# EAGLE board altera_dev_brd (EAGLE 4.16)
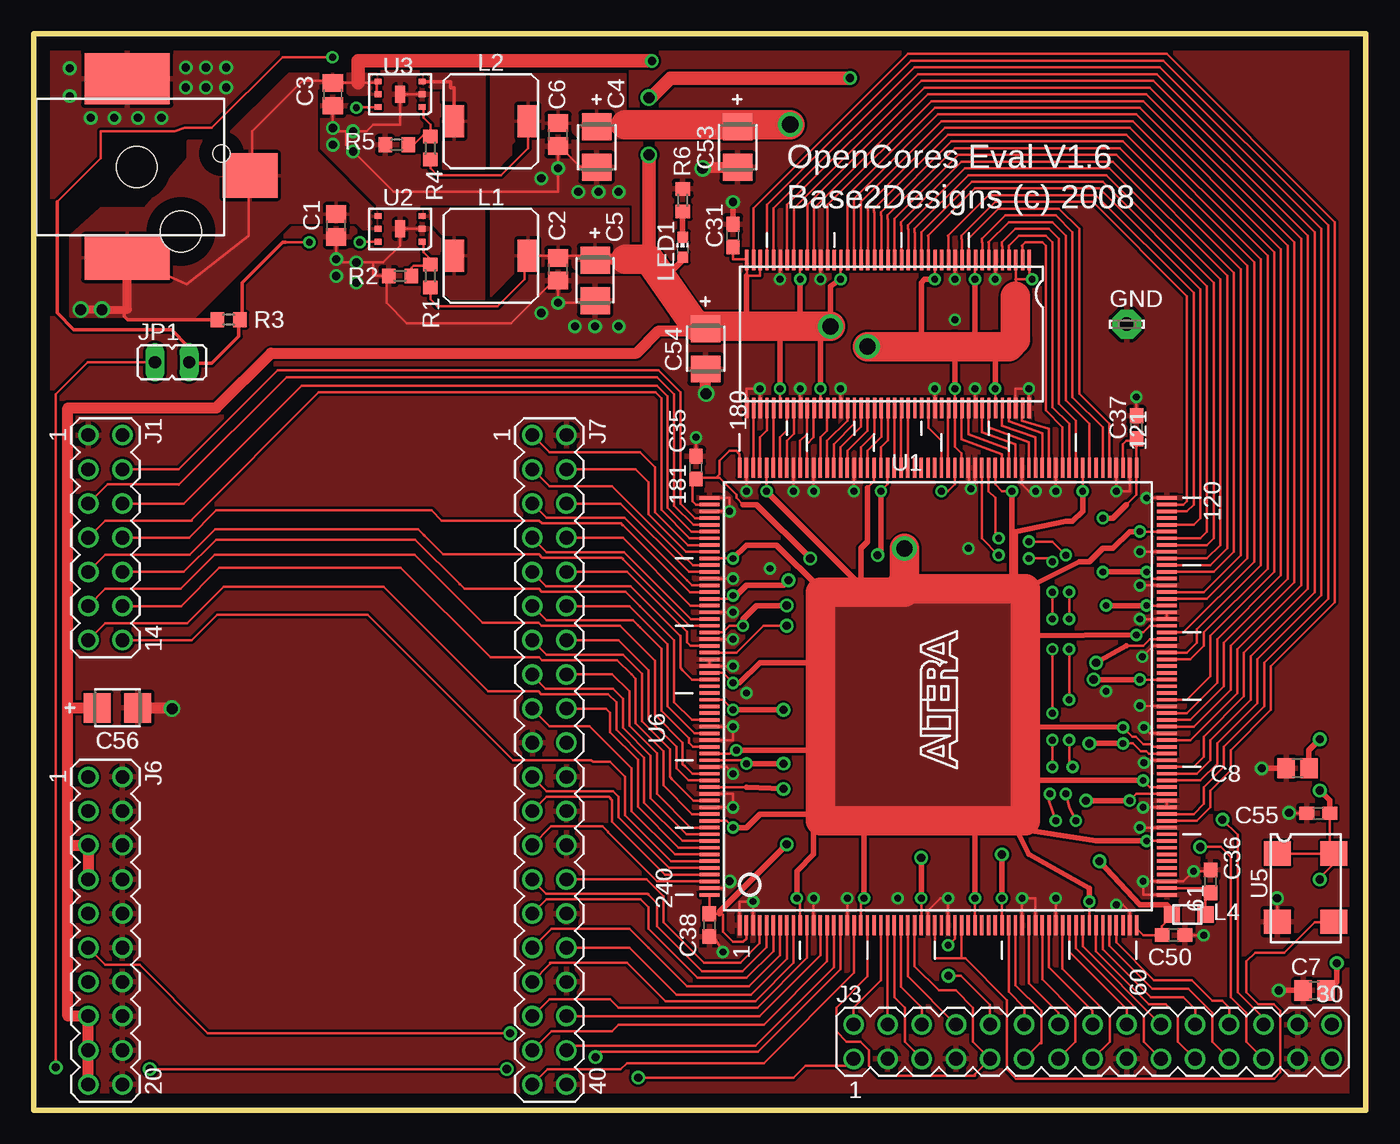
[diagram p1: board, top side]
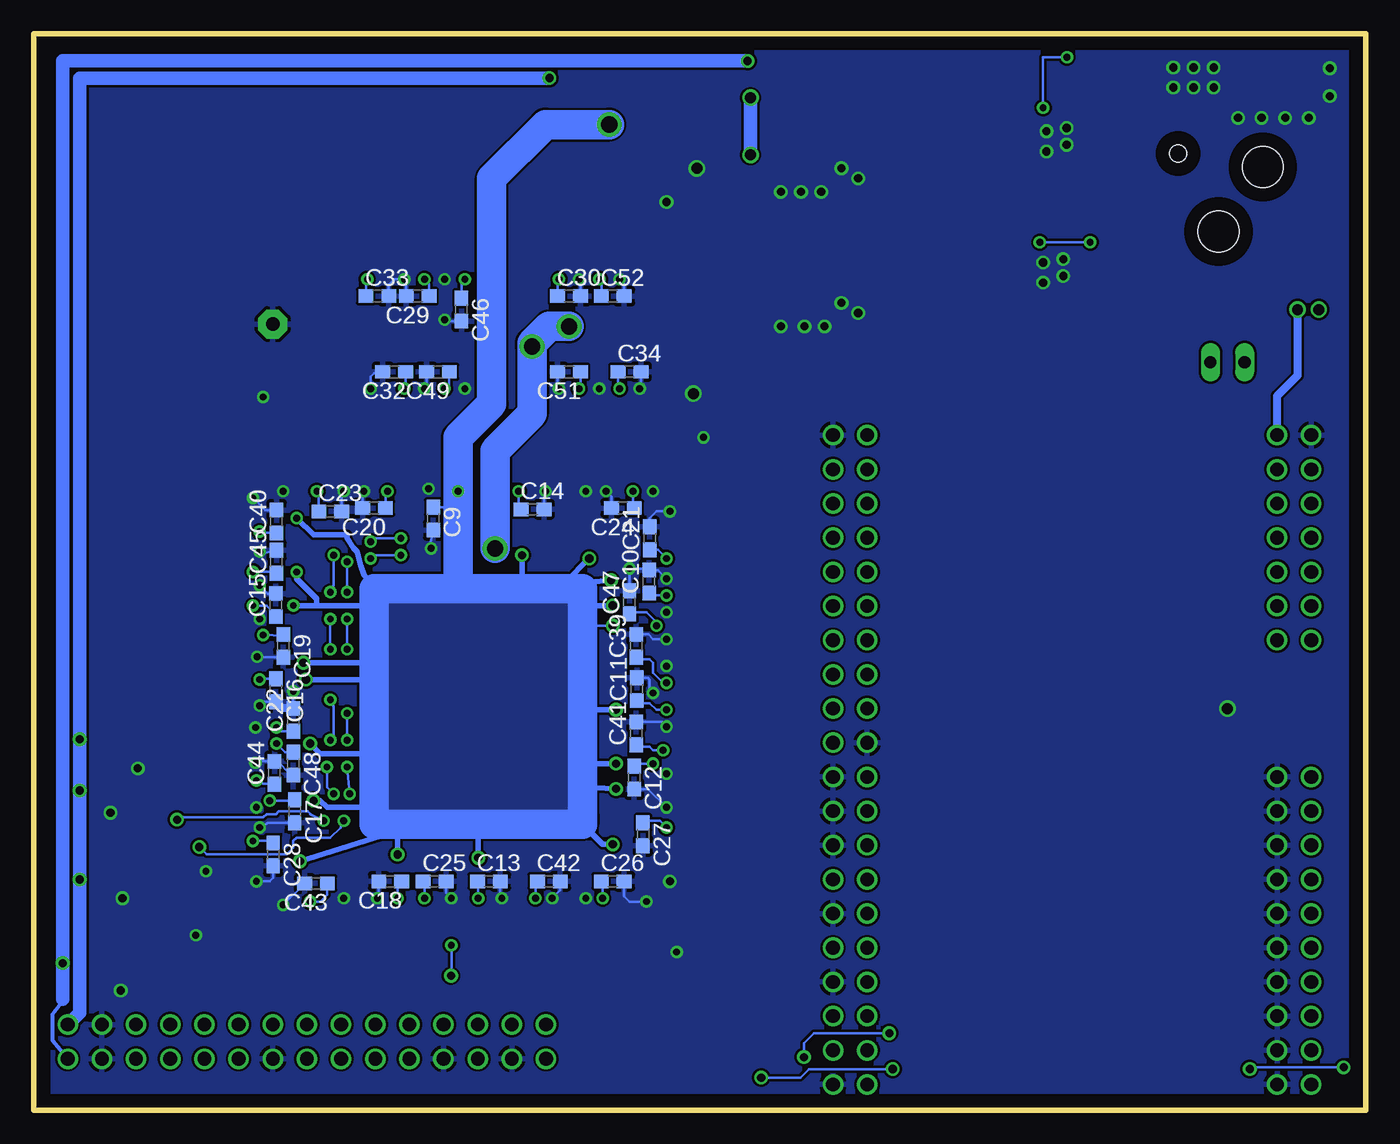
[diagram p2: board, bottom side, seen from below]

Size 99.06 x 80.01 mm. Coordinates in mm from the lower left corner, seen from the top.
Outline: 0,0 0,80.01 99.06,80.01 99.06,0 0,0
Copper layers (1*16): Top 0.035mm / dielectric 1.5mm / Bottom 0.035mm
Design rules "default": minimum track width 8mil, minimum drill 20mil, track to track 7mil, track to pad 7mil, pad to pad 7mil, via to via 7mil, smd to smd 7mil, copper to edge 40mil, drill to drill 8mil, minimum pad ring 10mil, minimum via ring 8mil, stop-mask expansion 3mil, vias tented up to drill 50mil, thermal gap 10mil

## Footprints (pad centres in the part's own frame; a part is rotated, then mirrored left to right if it is on the bottom)
C0805 = smd 1.3 x 1.5: 1 -0.85,0; 2 0.85,0
CT3528 = smd 2 x 2.2: + 1.5,0; - -1.5,0
C0603 = smd 1.1 x 1: 1 -0.85,0; 2 0.85,0
LSP10 = drill 1.016 pad 2.159 octagon: MP 0,0
MA07-2_TH = drill 1.016 pad 1.397 round: 1 -7.62,-1.27; 2 -7.62,1.27; 3 -5.08,-1.27; 4 -5.08,1.27; 5 -2.54,-1.27; 6 -2.54,1.27; 7 0,-1.27; 8 0,1.27; 9 2.54,-1.27; 10 2.54,1.27; 11 5.08,-1.27; 12 5.08,1.27; 13 7.62,-1.27; 14 7.62,1.27
RASH722 = smd 3.81 x 6.35: 1 -6.553,6.756 | smd 3.302 x 6.35: 2 6.731,6.756 | smd 3.302 x 4.064: 3 0.635,15.9 | hole 3.048: 0,7.468; 4.801,10.744 | hole 1.27: -1.016,13.767
MA15-2_TH = drill 1.016 pad 1.397 round: 1 -17.78,-1.27; 2 -17.78,1.27; 3 -15.24,-1.27; 4 -15.24,1.27; 5 -12.7,-1.27; 6 -12.7,1.27; 7 -10.16,-1.27; 8 -10.16,1.27; 9 -7.62,-1.27; 10 -7.62,1.27; 11 -5.08,-1.27; 12 -5.08,1.27; 13 -2.54,-1.27; 14 -2.54,1.27; 15 0,-1.27; 16 0,1.27; 17 2.54,-1.27; 18 2.54,1.27; 19 5.08,-1.27; 20 5.08,1.27; 21 7.62,-1.27; 22 7.62,1.27; 23 10.16,-1.27; 24 10.16,1.27; 25 12.7,-1.27; 26 12.7,1.27; 27 15.24,-1.27; 28 15.24,1.27; 29 17.78,-1.27; 30 17.78,1.27
MA10-2_TH = drill 1.016 pad 1.397 round: 1 -11.43,-1.27; 2 -11.43,1.27; 3 -8.89,-1.27; 4 -8.89,1.27; 5 -6.35,-1.27; 6 -6.35,1.27; 7 -3.81,-1.27; 8 -3.81,1.27; 9 -1.27,-1.27; 10 -1.27,1.27; 11 1.27,-1.27; 12 1.27,1.27; 13 3.81,-1.27; 14 3.81,1.27; 15 6.35,-1.27; 16 6.35,1.27; 17 8.89,-1.27; 18 8.89,1.27; 19 11.43,-1.27; 20 11.43,1.27
MA20-2_TH = drill 1.016 pad 1.397 round: 1 -24.13,-1.27; 2 -24.13,1.27; 3 -21.59,-1.27; 4 -21.59,1.27; 5 -19.05,-1.27; 6 -19.05,1.27; 7 -16.51,-1.27; 8 -16.51,1.27; 9 -13.97,-1.27; 10 -13.97,1.27; 11 -11.43,-1.27; 12 -11.43,1.27; 13 -8.89,-1.27; 14 -8.89,1.27; 15 -6.35,-1.27; 16 -6.35,1.27; 17 -3.81,-1.27; 18 -3.81,1.27; 19 -1.27,-1.27; 20 -1.27,1.27; 21 1.27,-1.27; 22 1.27,1.27; 23 3.81,-1.27; 24 3.81,1.27; 25 6.35,-1.27; 26 6.35,1.27; 27 8.89,-1.27; 28 8.89,1.27; 29 11.43,-1.27; 30 11.43,1.27; 31 13.97,-1.27; 32 13.97,1.27; 33 16.51,-1.27; 34 16.51,1.27; 35 19.05,-1.27; 36 19.05,1.27; 37 21.59,-1.27; 38 21.59,1.27; 39 24.13,-1.27; 40 24.13,1.27
JP1 = drill 0.914 long: 1 0,-1.27; 2 0,1.27
B82462G4 = smd 1.5 x 2.4: 1 -2.75,0; 2 2.75,0
IND_PANASONIC_0603 = smd 1.2 x 1.2: 1 0,0; 2 0,2.5
CHIP-LED0603 = smd 0.8 x 0.8: A 0,-0.75; C 0,0.75
R0603 = smd 1 x 1.1: 1 -0.85,0; 2 0.85,0
TSOP86 = smd 0.254 x 1.499: 1 -10.5,-5.5; 2 -10,-5.5; 3 -9.5,-5.5; 4 -9,-5.5; 5 -8.5,-5.5; 6 -8,-5.5; 7 -7.5,-5.5; 8 -7,-5.5; 9 -6.5,-5.5; 10 -6,-5.5; 11 -5.5,-5.5; 12 -5,-5.5; 13 -4.5,-5.5; 14 -4,-5.5; 15 -3.5,-5.5; 16 -3,-5.5; 17 -2.5,-5.5; 18 -2,-5.5; 19 -1.5,-5.5; 20 -1,-5.5; 21 -0.5,-5.5; 22 0,-5.5; 23 0.5,-5.5; 24 1,-5.5; 25 1.5,-5.5; 26 2,-5.5; 27 2.5,-5.5; 28 3,-5.5; 29 3.5,-5.5; 30 4,-5.5; 31 4.5,-5.5; 32 5,-5.5; 33 5.5,-5.5; 34 6,-5.5; 35 6.5,-5.5; 36 7,-5.5; 37 7.5,-5.5; 38 8,-5.5; 39 8.5,-5.5; 40 9,-5.5; 41 9.5,-5.5; 42 10,-5.5; 43 10.5,-5.5; 44 10.5,5.5; 45 10,5.5; 46 9.5,5.5; 47 9,5.5; 48 8.5,5.5; 49 8,5.5; 50 7.5,5.5; 51 7,5.5; 52 6.5,5.5; 53 6,5.5; 54 5.5,5.5; 55 5,5.5; 56 4.5,5.5; 57 4,5.5; 58 3.5,5.5; 59 3,5.5; 60 2.5,5.5; 61 2,5.5; 62 1.5,5.5; 63 1,5.5; 64 0.5,5.5; 65 0,5.5; 66 -0.5,5.5; 67 -1,5.5; 68 -1.5,5.5; 69 -2,5.5; 70 -2.5,5.5; 71 -3,5.5; 72 -3.5,5.5; 73 -4,5.5; 74 -4.5,5.5; 75 -5,5.5; 76 -5.5,5.5; 77 -6,5.5; 78 -6.5,5.5; 79 -7,5.5; 80 -7.5,5.5; 81 -8,5.5; 82 -8.5,5.5; 83 -9,5.5; 84 -9.5,5.5; 85 -10,5.5; 86 -10.5,5.5
DFN6 = smd 0.5 x 0.43: 1 -1.89,0.95; 2 -1.89,0; 3 -1.89,-0.95; 4 1.39,-0.95; 5 1.39,0; 6 1.39,0.95 | smd 0.73 x 1.27: 7 -0.25,0
OSC_7MM = smd 1.8 x 2: 1 -5.08,0; 2 0,0; 3 0,4.2; 4 -5.08,4.2
PQFP240 = smd 1.499 x 0.254: 1 -2.25,31.5; 2 -2.25,31; 3 -2.25,30.5; 4 -2.25,30; 5 -2.25,29.5; 6 -2.25,29; 7 -2.25,28.5; 8 -2.25,28; 9 -2.25,27.5; 10 -2.25,27; 11 -2.25,26.5; 12 -2.25,26; 13 -2.25,25.5; 14 -2.25,25; 15 -2.25,24.5; 16 -2.25,24; 17 -2.25,23.5; 18 -2.25,23; 19 -2.25,22.5; 20 -2.25,22; 21 -2.25,21.5; 22 -2.25,21; 23 -2.25,20.5; 24 -2.25,20; 25 -2.25,19.5; 26 -2.25,19; 27 -2.25,18.5; 28 -2.25,18; 29 -2.25,17.5; 30 -2.25,17; 31 -2.25,16.5; 32 -2.25,16; 33 -2.25,15.5; 34 -2.25,15; 35 -2.25,14.5; 36 -2.25,14; 37 -2.25,13.5; 38 -2.25,13; 39 -2.25,12.5; 40 -2.25,12; 41 -2.25,11.5; 42 -2.25,11; 43 -2.25,10.5; 44 -2.25,10; 45 -2.25,9.5; 46 -2.25,9; 47 -2.25,8.5; 48 -2.25,8; 49 -2.25,7.5; 50 -2.25,7; 51 -2.25,6.5; 52 -2.25,6; 53 -2.25,5.5; 54 -2.25,5; 55 -2.25,4.5; 56 -2.25,4; 57 -2.25,3.5; 58 -2.25,3; 59 -2.25,2.5; 60 -2.25,2; 121 31.75,2; 122 31.75,2.5; 123 31.75,3; 124 31.75,3.5; 125 31.75,4; 126 31.75,4.5; 127 31.75,5; 128 31.75,5.5; 129 31.75,6; 130 31.75,6.5; 131 31.75,7; 132 31.75,7.5; 133 31.75,8; 134 31.75,8.5; 135 31.75,9; 136 31.75,9.5; 137 31.75,10; 138 31.75,10.5; 139 31.75,11; 140 31.75,11.5; 141 31.75,12; 142 31.75,12.5; 143 31.75,13; 144 31.75,13.5; 145 31.75,14; 146 31.75,14.5; 147 31.75,15; 148 31.75,15.5; 149 31.75,16; 150 31.75,16.5; 151 31.75,17; 152 31.75,17.5; 153 31.75,18; 154 31.75,18.5; 155 31.75,19; 156 31.75,19.5; 157 31.75,20; 158 31.75,20.5; 159 31.75,21; 160 31.75,21.5; 161 31.75,22; 162 31.75,22.5; 163 31.75,23; 164 31.75,23.5; 165 31.75,24; 166 31.75,24.5; 167 31.75,25; 168 31.75,25.5; 169 31.75,26; 170 31.75,26.5; 171 31.75,27; 172 31.75,27.5; 173 31.75,28; 174 31.75,28.5; 175 31.75,29; 176 31.75,29.5; 177 31.75,30; 178 31.75,30.5; 179 31.75,31; 180 31.75,31.5 | smd 0.254 x 1.499: 61 0,-0.25; 62 0.5,-0.25; 63 1,-0.25; 64 1.5,-0.25; 65 2,-0.25; 66 2.5,-0.25; 67 3,-0.25; 68 3.5,-0.25; 69 4,-0.25; 70 4.5,-0.25; 71 5,-0.25; 72 5.5,-0.25; 73 6,-0.25; 74 6.5,-0.25; 75 7,-0.25; 76 7.5,-0.25; 77 8,-0.25; 78 8.5,-0.25; 79 9,-0.25; 80 9.5,-0.25; 81 10,-0.25; 82 10.5,-0.25; 83 11,-0.25; 84 11.5,-0.25; 85 12,-0.25; 86 12.5,-0.25; 87 13,-0.25; 88 13.5,-0.25; 89 14,-0.25; 90 14.5,-0.25; 91 15,-0.25; 92 15.5,-0.25; 93 16,-0.25; 94 16.5,-0.25; 95 17,-0.25; 96 17.5,-0.25; 97 18,-0.25; 98 18.5,-0.25; 99 19,-0.25; 100 19.5,-0.25; 101 20,-0.25; 102 20.5,-0.25; 103 21,-0.25; 104 21.5,-0.25; 105 22,-0.25; 106 22.5,-0.25; 107 23,-0.25; 108 23.5,-0.25; 109 24,-0.25; 110 24.5,-0.25; 111 25,-0.25; 112 25.5,-0.25; 113 26,-0.25; 114 26.5,-0.25; 115 27,-0.25; 116 27.5,-0.25; 117 28,-0.25; 118 28.5,-0.25; 119 29,-0.25; 120 29.5,-0.25; 181 29.5,33.75; 182 29,33.75; 183 28.5,33.75; 184 28,33.75; 185 27.5,33.75; 186 27,33.75; 187 26.5,33.75; 188 26,33.75; 189 25.5,33.75; 190 25,33.75; 191 24.5,33.75; 192 24,33.75; 193 23.5,33.75; 194 23,33.75; 195 22.5,33.75; 196 22,33.75; 197 21.5,33.75; 198 21,33.75; 199 20.5,33.75; 200 20,33.75; 201 19.5,33.75; 202 19,33.75; 203 18.5,33.75; 204 18,33.75; 205 17.5,33.75; 206 17,33.75; 207 16.5,33.75; 208 16,33.75; 209 15.5,33.75; 210 15,33.75; 211 14.5,33.75; 212 14,33.75; 213 13.5,33.75; 214 13,33.75; 215 12.5,33.75; 216 12,33.75; 217 11.5,33.75; 218 11,33.75; 219 10.5,33.75; 220 10,33.75; 221 9.5,33.75; 222 9,33.75; 223 8.5,33.75; 224 8,33.75; 225 7.5,33.75; 226 7,33.75; 227 6.5,33.75; 228 6,33.75; 229 5.5,33.75; 230 5,33.75; 231 4.5,33.75; 232 4,33.75; 233 3.5,33.75; 234 3,33.75; 235 2.5,33.75; 236 2,33.75; 237 1.5,33.75; 238 1,33.75; 239 0.5,33.75; 240 0,33.75

## Placement (x,y rotation side)
C1  4.7uF  [C0805]  22.5,65.75 270 top
C2  22uF  [C0805]  39,62.5 270 top
C3  4.7uF  [C0805]  22.25,75.5 270 top
C4  100uF  [CT3528]  41.87,71.58 90 top
C5  100uF  [CT3528]  41.75,61.67 90 top
C6  22uF  [C0805]  39,72.5 270 top
C7  4.7uF  [C0805]  95.25,8.89 180 top
C8  22uF  [C0805]  93.98,25.4 180 top
C9  0.1uF  [C0603]  69.35,43.96 270 bottom
C10  0.1uF  [C0603]  53.3,39.29 90 bottom
C11  0.1uF  [C0603]  54.2,31.29 90 bottom
C12  0.1uF  [C0603]  54.4,24.71 270 bottom
C13  0.1uF  [C0603]  65.21,17 0 bottom
C14  0.1uF  [C0603]  61.96,44.65 0 bottom
C15  0.1uF  [C0603]  81.05,37.54 90 bottom
C16  0.1uF  [C0603]  81.05,31.21 270 bottom
C17  0.1uF  [C0603]  79.65,22.21 270 bottom
C18  0.1uF  [C0603]  72.54,17 180 bottom
C19  0.1uF  [C0603]  80.5,34.5 270 bottom
C20  0.1uF  [C0603]  73.75,44.75 180 bottom
C21  0.1uF  [C0603]  53.25,42.5 90 bottom
C22  0.1uF  [C0603]  79.75,29 90 bottom
C23  0.1uF  [C0603]  77,44.5 0 bottom
C24  0.1uF  [C0603]  55.25,44.75 180 bottom
C25  0.1uF  [C0603]  69.25,17 0 bottom
C26  0.1uF  [C0603]  56,17 0 bottom
C27  0.1uF  [C0603]  53.75,20.5 270 bottom
C28  0.1uF  [C0603]  81.25,19 270 bottom
C29  0.1uF  [C0603]  70.5,60.5 180 bottom
C30  0.1uF  [C0603]  59.25,60.5 0 bottom
C31  0.1uF  [C0603]  52,65 90 top
C32  0.1uF  [C0603]  72.25,54.88 180 bottom
C33  0.1uF  [C0603]  73.5,60.5 0 bottom
C34  0.1uF  [C0603]  54.75,54.88 0 bottom
C35  0.1uF  [C0603]  49.25,47.75 90 top
C36  0.1uF  [C0603]  87.5,17 90 top
C37  0.1uF  [C0603]  82,50.75 90 top
C38  0.1uF  [C0603]  50.25,13.75 270 top
C39  0.1uF  [C0603]  54.25,34.5 90 bottom
C40  0.1uF  [C0603]  81,43.75 90 bottom
C41  0.1uF  [C0603]  54.25,28 90 bottom
C42  0.1uF  [C0603]  60.75,17 0 bottom
C43  0.1uF  [C0603]  78.06,16.85 180 bottom
C44  0.1uF  [C0603]  81.15,25.06 90 bottom
C45  0.1uF  [C0603]  81,40.75 90 bottom
C46  0.1uF  [C0603]  67.25,59.5 270 bottom
C47  0.1uF  [C0603]  54.75,37.75 90 bottom
C48  0.1uF  [C0603]  79.75,25.75 270 bottom
C49  0.1uF  [C0603]  69,54.88 180 bottom
C50  0.1uF  [C0603]  84.75,13 0 top
C51  0.1uF  [C0603]  59.25,54.88 180 bottom
C52  0.1uF  [C0603]  56,60.5 0 bottom
C53  100uF  [CT3528]  52.35,71.58 90 top
C54  100uF  [CT3528]  49.97,56.58 90 top
C55  0.1uF  [C0603]  95.52,22.06 180 top
C56  100uF  [CT3528]  6.23,29.9 180 top
GND  LSP10  [LSP10]  81.28,58.42 0 top
J1  MA07-2_TH  [MA07-2_TH]  5.33,42.55 270 top
J2  RASH722  [RASH722]  0.2,70.1 270 top
J3  MA15-2_TH  [MA15-2_TH]  78.74,5.08 0 top
J6  MA10-2_TH  [MA10-2_TH]  5.33,13.34 270 top
J7  MA20-2_TH  [MA20-2_TH]  38.35,26.04 270 top
JP1  [JP1]  10.29,55.58 270 top
L1  B82462G4332  [B82462G4]  34,63.5 0 top
L2  B82462G4332  [B82462G4]  34,73.5 0 top
L4  EXC-ML20A390U  [IND_PANASONIC_0603]  87.14,14.54 90 top
LED1  [CHIP-LED0603]  48.26,64.14 0 top
R1  158K  [R0603]  29.5,62 270 top
R2  49.9K  [R0603]  27.25,62 0 top
R3  100K  [R0603]  14.5,58.75 0 top
R4  24.9K  [R0603]  29.5,71.5 270 top
R5  49.9K  [R0603]  27,71.75 0 top
R6  330R  [R0603]  48.26,67.63 270 top
U1  MT48LC4M32B2TG-6  [TSOP86]  63.53,57.68 180 top
U2  ST1S06PMR  [DFN6]  27,65.5 180 top
U3  ST1S06PMR  [DFN6]  27,75.5 180 top
U5  CB3LV-3I-48M0000  [OSC_7MM]  92.48,13.99 270 top
U6  EP2C20Q240C8N  [PQFP240]  84,16 90 top

## Tracks (layer width: path | path; a pad name or v marks a point on that pad's centre or on a via)
+1V2  (via drill 0.51, 0.61, 1.22)
  Top 0.203: R4.2 29.5,70 30,69.5 34.75,69.5 36.75,71.5 L2.2 | 49.25,46.75 49.25,46.5 | U6.182 49.25,45 49,45.25 49,46.5 49.25,46.75 | 49.25,46.75 C35.1 49.25,47 50.75,47 | U6.123 81,49.5 81.25,49.75 81.75,49.75 82,50 C37.1 U6.121 82,45.75 81.25,45 | U6.180 52.5,48.75 52.25,49 51.75,49 51,48.25 51,47.25 50.75,47 | U6.240 C38.1 51,14.6 | 51,14.6 51.15,14.6 51.25,14.5 51.25,13.25 52,12.5 52.75,12.5 53,12.75 U6.2 | v67.5,46 68,46 68.5,46.5 U6.148 | U6.108 83.25,39.5 v82.75,40 | v82.75,37.5 U6.104 | U6.158 63.5,46.5 v63,46 | U6.201 51.25,35.5 51.75,36 v52.75,36 | U6.196 51.75,38 v52,38.25 | U6.211 51.25,30.5 v52,29.75 | U6.220 52.75,26 v53,25.75 | v66,15.75 U6.28 | v72,15.75 U6.40 | U6.76 82,23.5 v81.5,23 | v82.25,32 U6.93 | 50.75,47 51,47 52.25,45.75 52.25,45.5 52.75,45 | U6.204 52.25,34 54.25,36 v56,36 | 53,24 U6.224 | 51,14.6 51.1,14.6 | U6.99 83,35 82.5,34.5 81.25,34.5 | U6.60 82,13.5 82.5,13 C50.1 83.9,13.65 84.75,14.5 84.71,14.54 L4.2 | U6.82 82.94,26.5 82.75,26.69 82.31,26.69 81.75,27.25 v81,27.25
  Top 0.406: v63,46 63,41.5 v62.75,41.25 | 52.75,45 53.75,45 v57.75,41 | v52,38.25 52.25,38.25 53,39 55.75,39 v56.13,39.38 | v52.75,36 52.75,36.5 53.75,37.5 v56,37.5 | v55.75,29.75 v52,29.75 | v55.75,25.75 v53,25.75 | v55.75,23.87 53,24 | 51,14.6 51,14.75 v56,19.75 | v66,18.75 v66,15.75 | v72,19 v72,15.75 | L4.2 84.64,14.86 84.25,15.25 82.25,15.25 v79.25,18.5 | v78.25,23 v81.5,23 | v78.5,27.25 v81,27.25 | v78.81,32 v82.25,32 | v79,33.25 81.25,34.5 | v79.75,37.5 v82.75,37.5 | v79.5,40 v82.75,40 | v79.5,44 80.25,44 81.25,45
  Top 0.813: C4.+ 43.83,73.08 43.88,73.12 | 44,73.25 43.88,73.12 | 43.88,73.12 44,73 44.08,73.08 C53.+
  Top 2.184: v56.25,73.25 44,73.25
  Bottom 0.203: C9.1 67.56,44.81 67.5,44.75 | C45.1 81,40 v82.75,40 | C15.1 81,36.75 81.75,37.5 v82.75,37.5 | C14.1 62.9,44.65 63,44.75 v63,46 | v52.75,36 52.75,36.25 53.5,37 54.75,37 C47.1 | C10.1 53.25,38.5 53,38.25 v52,38.25 | v52,29.75 52.75,29.75 53.25,30.25 54,30.25 C11.1 | C11.1 54.25,30.5 | C11.1 | C12.1 54.4,25.65 54.5,25.75 v53,25.75 | C13.1 66,17 v66,15.75 | C18.1 71.5,17 72,16.5 v72,15.75 | C17.1 79.69,23.06 79.75,23 v81.5,23 | C48.1 80.35,26.6 v81,27.25 | C16.1 82.19,32.06 v82.25,32 | 58.25,36 v56,36
  Bottom 0.406: 62.75,38.5 62.75,38.75 v62.75,41.25 | 59.5,38.75 59.5,39.25 v57.75,41 | v56.13,39.38 57.75,39.25 58.25,38.75 | 58.25,38 58,38 57.5,37.5 v56,37.5 | 58.25,29.75 v55.75,29.75 | 58.5,25.75 58.25,25.75 v55.75,25.75 | 58.25,24 v55.75,23.87 | v56,19.75 56.75,19.75 59,22 58.25,22 58,22 | v66,18.75 66,21 66.25,21.25 | 72,21.25 72,20.75 | 72,20.75 v72,19 | 72,20.75 73.75,22 | 72,20.75 v79.25,18.5 | 73.75,27.5 74,27.5 74.25,27.25 | 73.5,32 73.75,32 v78.81,32 | 73.75,37.5 78,37.5 | 78,37.5 v79.75,37.5 | 74.25,39.25 74,38 73.75,38.75 74,39 74,39.25 74.5,39.75 74.75,40.5 75,41.5 75.25,41.75 75.75,42.5 75.75,42.75 78.25,42.75 v79.5,44 | 78,37.5 78,38 79.5,39.5 v79.5,40 | v78.5,27.25 77.75,26.5 73.75,26.5 | v78.25,23 77.75,23 77.25,22.5 73.75,22.5 | 73.75,33 74,33 73.75,33.25 v79,33.25
  Bottom 2.184: v56.25,73.25 61,73.25 65,69.25 65,52.5 67.5,50 v67.5,46 67.5,44.75 67.5,38.75 | 67.5,38.75 62.75,38.75 59.5,38.75 58.25,38.75 58.25,38 58.25,36 58.25,29.75 58.25,25.75 58.25,24 58.25,22 58.25,21.25 66.25,21.25 72,21.25 73.75,21.25 73.75,22 73.75,22.5 73.75,26.5 73.75,27.5 73.75,32 73.75,33 73.75,33.25 73.75,37.5 73.75,38.75 67.5,38.75
  pour Top: 34,77 44,77 44,72.25 40.5,72.25 40,72.75 39.75,73 38,73 37.5,72.5 36.25,72.5 35.5,71.75 35.5,71 34.75,70.25 34.5,70 34,70
  pour Bottom: 58,39 74,39 74,21 58,21
+3V3  (via drill 0.51, 0.61, 0.81, 1.22)
  Top 0.203: R1.2 29.5,60.25 30,59.75 34.5,59.75 36.5,61.75 36.5,63.25 L1.2 39,63.5 C2.1 39,63.25 39.25,63.5 41.5,63.5 41.75,63.25 C5.+ | C31.1 52,63.25 53,63.25 53.03,63.22 U1.43 53.03,62.03 53,62 54,62 54,63.25 54.03,63.22 U1.41 | U1.35 57.03,63.03 57,63 v57,61.75 | U1.29 60.03,63.03 60,63 v60,61.75 | U1.49 55.53,52.22 55.5,52.25 v55.5,53.63 | U1.55 58.53,52.22 58.5,52.25 v58.5,53.63 | U1.15 67.03,63.03 67,63 v67,61.75 | U1.9 70.03,63.03 70,63 v70,61.75 | U1.1 74.03,61.97 v74.25,61.75 73,61.75 73.03,61.78 U1.3 73.03,60.53 73,60.5 | v68.5,53.63 68.5,52.25 68.53,52.22 U1.75 68.56,52.18 | U1.81 71.53,53.47 v71.5,53.63 | v54.5,46 U6.176 | U6.207 51.25,32.5 v52,31.75 | U6.219 51.75,26.5 v52.25,26.75 | U6.229 51.5,21.5 v52,21 | U6.10 57,15.5 v56.75,15.75 | U6.19 61.5,15.5 v61.75,15.75 | v70,15.75 U6.36 | v82.75,20 U6.69 | U6.77 83,24 v82.5,24.5 | U6.101 83,36 82.5,35.5 82.25,35.5 v82,35.31 | v82.25,43 U6.115 | 78,48 U6.129 v78,46 | v52,41 U6.190 | v78.5,15.5 U6.53 | U6.160 62.5,46.75 62,46.25 | v72.75,46 72,46 71.5,46.5 U6.142 | 72,21.5 72,21 73,21 | U6.83 83.19,27 83,27.19 82.5,27.19 81.94,27.75 81.69,27.75 v81,28.44 | 68.56,52.18 68.56,52.19 | 68.56,52.18 68.5,52.12 68.5,49.29 68.98,48.82 68.98,47.86 69,47.84 U6.147 | U5.1 96.63,19.07 96.65,19.05 | v95.63,17.14 95.5,17.14 96.68,18.32 U5.4 96.67,19.07 96.65,19.05 | C55.1 96.37,19.33 96.65,19.05
  Top 0.406: v67,61.75 66.25,61.75 66,61.5 66,56.75 | 70,56.75 v70,61.75 | 71.5,56.75 71.5,56.5 71.53,56.47 71.53,53.47 | 68.5,56.75 v68.5,53.63 | 58.5,58.25 v58.5,53.63 | 55.5,58.25 v55.5,53.63 | v60,61.75 59.25,61.25 v59.25,58.25 | 57,58.25 v57,61.75 | 53,58.25 53,62 | 61.75,38.5 61.75,38.75 61.38,39.12 | 61.38,39.12 v54.5,46 | 62,46.25 62,42.25 61.5,41.75 61.5,39.25 61.38,39.12 | v52,41 53,42 55.25,42 58.5,38.75 58.5,38.5 | v52,31.75 52.5,31.75 54,33.25 58.5,33.25 | 58.5,26.75 v52.25,26.75 | v52,21 53,21 54,22 58.5,22 | v56.75,15.75 56.75,17.75 58,19 58,21.25 58.25,21.5 58.5,21.5 | v61.75,15.75 61.75,21.25 62,21.5 | v70,15.75 70,21.25 69.75,21.5 | v78.5,15.5 78.5,16.5 74,19 73,21 | 73.75,22.75 72.75,21 79,20 v82.75,20 | 73.75,24.5 v82.5,24.5 | 73.75,28.5 v81,28.44 | v82.25,43 81.5,43 80.25,41.75 79.5,41.75 78.5,40.75 77.75,40.75 73.75,38.75 | v78,46 78,44.5 77.25,43.75 76.75,43.75 73,43 73,38.5 73.25,39.25 73.25,38.75 | 71.5,38.75 71.5,39.25 72.75,38.5 v72.75,46 | v82,35.31 74.25,35.25 73.5,36 73.75,36 | C55.1 96.37,23.01 v95.63,23.75 | C8.1 94.83,26.76 v95.63,27.56 | 46.79,61.77 46.85,61.77 48.26,63.18 LED1.A
  Top 0.61: J6.17 4.06,4.57 | 50.16,57.91 50,58.08 C54.+
  Top 0.813: 44,63.25 41.75,63.25 | 48.77,58.94 48.69,58.94 48.5,58.75 49.17,58.08 C54.+ | J6.19 J6.17 J6.15 2.54,6.99 2.54,19.68 | 50.16,57.91 46.48,57.91 44.83,56.26 17.65,56.26 13.59,52.2 2.54,52.2 2.54,29.97 | 2.54,19.68 2.54,29.97 | C56.+ 2.54,29.9 2.54,29.97 | J6.5 4.06,19.81 | J6.5 J6.7 | 2.54,19.68 J6.5
  Top 1.016: 45.75,63.25 v45.75,71 | v45.75,75.25 45.91,75.25 47.37,76.71 v60.71,76.71
  Top 2.184: 44,63.25 45.75,63.25 46.79,61.77 48.77,58.94 49.25,58.25 53,58.25 55.5,58.25 57,58.25 58.5,58.25 v59.25,58.25 | 73,60.5 73,57.25 72.5,56.75 71.5,56.75 70,56.75 68.5,56.75 66,56.75 v62,56.75 | v64.75,41.75 64.75,38.5 61.75,38.5 58.5,38.5 58.5,33.25 58.5,26.75 58.5,22 58.5,21.5 62,21.5 69.75,21.5 72,21.5 73.75,21.5 73.75,22.75 73.75,24.5 73.75,28.5 73.75,36 73.75,38.75 73.25,38.75 71.5,38.75 64.5,38.75 64.5,39
  Bottom 0.203: C52.1 56.85,61.6 v57,61.75 | C30.1 60.1,61.65 v60,61.75 | C34.1 55.6,53.6 v55.5,53.63 | C51.1 58.4,53.6 v58.5,53.63 | C46.1 67.25,61.5 v67,61.75 | C29.1 69.65,61.4 v70,61.75 | C33.1 74.35,61.65 v74.25,61.75 | C49.1 68.15,53.85 v68.5,53.63 | C32.1 71.4,53.6 v71.5,53.63 | C24.1 54.25,44.75 54.5,45 v54.5,46 | v52,31.75 52.25,31.75 53,32.5 53,33.25 53.25,33.5 54,33.5 54.25,33.75 C39.1 | v52.25,26.75 53,26.75 53.25,27 54,27 54.25,27.25 C41.1 | v52,21 52.5,21.5 53.75,21.5 C27.1 | C26.1 56.75,17 v56.75,15.75 | C42.1 61.5,17 61.75,16.75 v61.75,15.75 | C25.1 70,17 v70,15.75 | C28.1 81.25,20 v82.75,20 | v82.5,24.5 82.25,24.5 82,24.25 81.25,24.25 81.21,24.21 C44.1 | C22.1 80.65,28.15 v81,28.44 | C40.1 82.15,42.9 v82.25,43 | C23.1 77.85,45.85 v78,46 | C21.1 52.65,41.65 v52,41 | v78.5,15.5 77.75,15.5 77.25,16 77.25,16.75 77.21,16.79 C43.1 | C19.1 80.5,35.25 v82,35.31 | C20.1 72.9,45.85 v72.75,46
  Bottom 1.016: v45.75,71 v45.75,75.25 | v60.71,76.71 95.63,76.71 v95.63,27.56 v95.63,23.75 v95.63,17.14 95.63,8.13 | 95.63,8.13 95.63,8 | J3.30 95.63,7.24 95.63,8.13
  Bottom 2.184: v64.75,41.75 64.75,49 62,51.75 v62,56.75 62,57 60.75,58.25 v59.25,58.25
  pour Top: 34,67 44.25,67 44.25,62.25 40.75,62.25 40.5,62.25 40,62.75 39.75,62.75 37.75,62.75 37.5,62.5 36,62.5 34,60.5
  pour Top: 59,39 74,39 74,21 59,21
+5V  (via drill 0.61, 0.81)
  Top 0.203: U3.5 25.5,75.5 25.5,76.5 | 16.25,68.5 16.25,72.75 20,76.5 22,76.5 22.25,76.25 C3.1 24.13,76.35 25.35,76.35 25.5,76.5 | J2.2 11.37,61.37 16,65 16,68.5 16.04,68.47 J2.3 | 25.5,76.5 25.45,76.45 U3.4
  Top 0.254: R3.1 7,58.75 6.75,59 6.75,63.25 6.96,63.46 | 6.96,63.46 7,63.5 | J2.2 6.96,63.46
  Top 0.406: C7.1 96.27,8.89 96.9,9.53 v96.9,10.92
  Top 0.61: J2.2 7,63.37 7,59.5 v5.08,59.5 v3.5,59.5
  Top 1.016: v45.97,77.98 24.13,77.98 24.13,76.35
  Bottom 0.305: J3.29 97.66,5.21 97.66,7.11 96.9,8.13
  Bottom 0.406: 96.9,8.26 96.9,8.13
  Bottom 0.61: J1.2 6.73,50.16 6.6,50.29 6.6,53.09 5.08,54.61 v5.08,59.5 5.08,59.56
  Bottom 1.016: v45.97,77.98 96.9,77.98 v96.9,10.92 96.9,8.26
  pour Top: 11.5,72 14,72 19,77 25.5,77 25.5,75.5 23.5,75.5 23,76 21,76 21,71.25 25.5,66.75 25.5,65.5 24.5,65.5 24,66 19,66 12,59 2.75,59 2.75,65 5,67 8.25,67 11.5,70.75
A0
  Top 0.203: U1.25 62.03,66.97 62,67 62,67.25 67.75,73 81.5,73 91.25,63.25 91.25,40.5 86.5,35.75 86.5,34.75 85.75,34 U6.97
A1
  Top 0.203: U1.26 61.53,67.47 61.5,67.5 67.5,73.5 81.75,73.5 91.75,63.5 91.75,40.25 87,35.5 87,34.5 86,33.5 U6.96
A2
  Top 0.203: U1.27 61.03,63.03 61,63 61,67.75 67.25,74 82,74 92.25,63.75 92.25,40 87.5,35.25 87.5,32.25 85.75,30.5 U6.90
A3
  Top 0.203: U6.166 59.5,49.5 61,51 61,51.75 61.03,51.78 U1.60
A4
  Top 0.203: U1.61 61.53,50.78 60,49.25 U6.165
A5
  Top 0.203: U1.62 62.03,52.22 62,52.25 62,50.5 60.5,49 U6.164
A6
  Top 0.203: U1.63 62.53,50.28 61.5,49.25 U6.162
A7
  Top 0.203: U1.64 63.03,50.03 62,49 U6.161
A8
  Top 0.203: U1.65 63.53,49.78 63,49.25 U6.159
A9
  Top 0.203: U1.66 64.03,52.03 64,52 U6.157
A10
  Top 0.203: U1.24 62.53,66.72 62.5,66.75 62.5,67 68,72.5 81.25,72.5 90.75,63 90.75,40.75 85.5,35.5 U6.100
A11
  Top 0.203: U1.21 64,63.18 64,66.25 68.75,71 80.5,71 89.25,62.25 89.25,41.5 87.75,40 U6.109
BA0
  Top 0.203: U1.22 63.53,66.22 63.5,66.25 63.5,66.5 68.5,71.5 80.75,71.5 89.75,62.5 89.75,41.25 87,38.5 U6.106
BA1
  Top 0.203: U1.23 63.03,66.47 63,66.5 63,66.75 68.25,72 81,72 90.25,62.75 90.25,41 87.25,38 U6.105
CAS_N
  Top 0.203: U1.18 65.53,65.22 65.5,65.25 65.5,65.5 69.5,69.5 79.75,69.5 87.75,61.5 87.75,42.5 87.25,42 U6.113
CKE
  Top 0.203: U1.67 64.53,52.03 64.5,52 U6.156
CLK
  Top 0.203: U1.68 65.03,52.03 65,52 U6.155
CS_N
  Top 0.203: U1.20 64.53,65.72 64.5,65.75 64.5,66 69,70.5 80.25,70.5 88.75,62 88.75,41.75 87.5,40.5 U6.110
DQ0
  Top 0.203: U1.2 73.53,64.22 73.5,64.25 73.75,64.5 75,64.5 75.25,64.25 75.25,52 76.5,50.75 U6.132
DQ1
  Top 0.203: U1.4 72.53,64.22 72.5,64.25 73.25,65 75.25,65 75.75,64.5 75.75,52.25 77,51 U6.131
DQ2
  Top 0.203: U1.5 72.03,64.22 72,64.25 72,64.5 73,65.5 75.5,65.5 76.25,64.75 76.25,52.5 77.5,51.25 U6.130
DQ3
  Top 0.203: U1.7 71.03,64.47 71,64.5 72.5,66 75.75,66 76.75,65 76.75,52.75 78.5,51 U6.128
DQ4
  Top 0.203: U1.8 70.53,64.47 70.5,64.5 70.5,64.75 72.25,66.5 76,66.5 77.25,65.25 77.25,53 79.5,50.75 U6.126
DQ5
  Top 0.203: U1.10 69.53,64.72 69.5,64.75 71.75,67 76.25,67 77.75,65.5 77.75,53.25 80,51 U6.125
DQ6
  Top 0.203: U1.11 69.03,64.72 69,64.75 69,65 71.5,67.5 78.75,67.5 85.75,60.5 85.75,45.25 85.5,45 U6.119
DQ7
  Top 0.203: U1.13 68.03,64.97 68,65 71,68 79,68 86.25,60.75 86.25,45 85.75,44.5 U6.118
DQ8
  Top 0.203: U6.149 68,52 | 68,52 U1.74 | 68,52 68.03,52.03
DQ9
  Top 0.203: 69,52 69.03,52.03 69,52.25 U1.76 69,52.12 69,49.88 72,48.75 U6.141
DQ10
  Top 0.203: 69.5,52.12 69.5,52 69.53,52.03 U1.77 69.5,52.12 | 69.5,52.12 69.5,52.75 | U6.140 72.5,49.12 69.5,50.25 69.5,52.12
DQ11
  Top 0.203: U1.79 70.53,52.22 70.5,52.25 70.5,52.5 | U1.79 70.5,51.75 | U6.139 73,49.5 70.5,50.38 70.5,52.12 U1.79
DQ12
  Top 0.203: U6.137 74,49.62 71,50.75 71,52.12 U1.80
DQ13
  Top 0.203: 72.03,52.22 U1.82 72,52.12 72,50.88 74.5,50 U6.136
DQ14
  Top 0.203: U6.135 75,50.31 72.5,51.19 72.5,52.12 U1.83
DQ15
  Top 0.203: U6.134 75.5,50.62 73.5,51.25 73.5,52.12 U1.85
DQ16
  Top 0.203: U1.31 59.03,67.28 66.75,75 82.5,75 93.25,64.25 93.25,39.5 88.5,34.75 88.5,31.5 86,29 U6.87
DQ17
  Top 0.203: U1.33 58.03,67.03 66.5,75.5 82.75,75.5 93.75,64.5 93.75,39.25 89,34.5 89,31.25 86.25,28.5 U6.86
DQ18
  Top 0.203: U1.34 57.53,67.28 66.25,76 83,76 94.25,64.75 94.25,39 89.5,34.25 89.5,31 86,27.5 U6.84
DQ19
  Top 0.203: U1.36 56.53,67.03 66,76.5 83.25,76.5 94.75,65 94.75,38.75 90,34 90,30.75 87,27.75 87,26.25 86.25,25.5 U6.80
DQ20
  Top 0.203: U1.37 56.03,67.28 65.75,77 83.5,77 95.25,65.25 95.25,38.5 90.5,33.75 90.5,30.5 87.5,27.5 87.5,26 86.5,25 U6.79
DQ21
  Top 0.203: U1.39 55.03,67.03 65.5,77.5 83.75,77.5 95.75,65.5 95.75,38.25 91,33.5 91,30.25 88,27.25 88,25.75 86.75,24.5 U6.78
DQ22
  Top 0.203: U1.40 54.53,67.28 65.25,78 84,78 96.25,65.75 96.25,38 91.5,33.25 91.5,30 88.5,27 88.5,25.5 87,24 87,22.75 86.25,22 U6.73
DQ23
  Top 0.203: U1.42 53.53,67.03 65,78.5 84.25,78.5 96.75,66 96.75,37.75 92,33 92,29.75 89,26.75 89,25.25 87.5,23.75 87.5,22.5 86.5,21.5 U6.72
DQ24
  Top 0.203: U6.178 53.5,48 53.53,48.03 U1.45
DQ25
  Top 0.203: U1.47 54.53,50.53 54,50 U6.177
DQ26
  Top 0.203: U1.48 55.03,52.22 55,52.25 U6.175
DQ27
  Top 0.203: U1.50 56.03,50.53 55.5,50 U6.174
DQ28
  Top 0.203: U1.51 56.53,50.28 56,49.75 U6.173
DQ29
  Top 0.203: U1.53 57.53,52.03 57.5,52 57.5,50.25 57,49.75 U6.171
DQ30
  Top 0.203: U1.54 58.03,52.22 58,52.25 58,50 57.5,49.5 U6.170
DQ31
  Top 0.203: U1.56 59.03,52.03 59,52 59,50.5 58.5,50 U6.168
DQM0
  Top 0.203: U1.16 66.53,64.97 66.5,65 70,68.5 79.25,68.5 86.75,61 86.75,44 86.25,43.5 U6.116
DQM1
  Top 0.203: U1.71 66.53,50.72 67.5,49.75 U6.150
DQM2
  Top 0.203: U1.28 60.53,67.97 60.5,68 67,74.5 82.25,74.5 92.75,64 92.75,39.75 88,35 88,31.75 85.75,29.5 U6.88
DQM3
  Top 0.203: U6.167 59,49.75 60.5,51.25 60.5,51.75 60.53,51.78 U1.59
FLASH_SPI_CLK
  Top 0.203: U6.47 75.5,10.61 78.74,7.37 J3.16
FPGA_CONF_CLK
  Top 0.203: U6.26 65,9.93 J3.8
FPGA_CONF_DONE  (via drill 0.51, 0.61)
  Top 0.203: U6.144 70.5,42.5 v71.75,41.25 | v74,41 75.5,41 v75.75,40.75 | v75.75,25.5 v75.75,27.5 | v75.56,23.5 75.5,23 v76,21.5 | v75.75,36.5 v75.75,38.5 | v75.75,29.5 v75.75,34.25 | v86.74,19.56 88.27,19.56 89.03,18.8 89.03,8.38 90.17,7.24 90.17,5.08 J3.25
  Bottom 0.203: v71.75,41.25 73.75,41.25 v74,41 | v75.75,38.5 v75.75,40.75 | v75.75,27.5 v75.75,29.5 | v75.56,23.5 v75.75,25.5 | v76,21.5 76.25,21 77,20.25 79.5,20.25 79.75,20 79.75,19.5 80.25,19 86.18,19 v86.74,19.56 | v75.75,34.25 v75.75,36.5
FPGA_CONF_EN_N  (via drill 0.51, 0.61)
  Top 0.203: U6.33 68.5,12.75 v68,12.25 | v68.02,9.98 68.94,9.98 71.09,7.82 71.09,6.38 J3.10
  Bottom 0.203: v68,12.25 68,10 v68.02,9.98
FPGA_STS_N  (via drill 0.51, 0.61)
  Top 0.203: U6.143 71,46 71.5,45.5 71.5,42.75 v71.75,42.5 | v74,42.25 75.75,42.25 v76.75,41.25 | v77,27.5 77,25.75 v77.25,25.5 | v76.75,23.5 77,22.5 v77.5,21.5 | v77,36.5 v77,38.5 | v77,30.5 v77,34.25 | v88.39,21.59 89.53,20.45 89.53,8.76 91.44,6.86 J3.26
  Bottom 0.203: v71.75,42.5 73.75,42.5 v74,42.25 | v76.75,41.25 76.75,39 v77,38.5 | v77,30.5 76.75,30 76.75,27.75 v77,27.5 | v77.25,25.5 77.25,24 v76.75,23.5 | v77.5,21.5 78.5,22 78.5,22.01 78.69,22.2 80.82,22.2 81.02,22 81.75,22 82,21.75 88.32,21.75 88.32,21.66 v88.39,21.59 | v77,34.25 v77,36.5
FPGA_TCK
  Top 0.203: J3.4 U6.23
FPGA_TDI
  Top 0.203: U6.22 63,9.66 60.96,7.62 J3.2
FPGA_TDO
  Top 0.203: U6.25 64.5,9.16 66.04,7.62 J3.6
FPGA_TMS
  Top 0.203: 64,14 U6.24 64,8.39 64.77,7.62 64.77,5.08 J3.5
GND  (via drill 0.51, 0.61, 0.81)
  Top 0.203: U1.58 60,52.18 v60,53.63 | U1.52 57,52.18 v57,53.63 | U1.46 54,52.18 v54,53.63 53,53.63 53,52 53.03,52.03 U1.44 | U1.86 74,52.18 v74,53.63 73,53.63 73,53 U1.84 | U1.78 70,52.18 v70,53.63 | U1.72 67,52.18 v67,53.63 | U1.38 55.5,63.18 v55.5,61.75 | U1.32 58.5,63.18 v58.5,61.75 | U1.12 68.5,63.18 v68.5,61.75 | U1.6 71.5,63.18 v71.5,61.75 | U6.12 v58,15.75 | U6.17 v60.5,15.75 | U6.32 v68,15.75 67.44,15.75 66.5,14.81 U6.29 | U6.43 v73.5,15.75 74.5,15.75 U6.45 | U6.48 v76,15.75 | v82.25,21 U6.71 | U6.75 U6.74 v82.5,22.5 | v82.25,30.06 U6.89 | v82.25,36.5 U6.102 U6.103 | v82.25,39 U6.107 | v82.25,41.5 U6.112 | v76,46 U6.133 | v61,46 U6.163 | U6.169 v58,46 | v56.5,46 U6.172 | U6.193 v52,39.5 | U6.198 v52,37 | U6.202 v52,35 | U6.205 U6.206 v52,33 | U6.215 v52,28.5 52,27.5 U6.217 | U6.225 52,23.5 v52,22.5 U6.227 | U6.61 82.5,16 v82.5,17 U6.63 85.5,17 v86.25,17.75 87.5,17.75 C36.2 | v82.75,45.5 U6.120 | U6.124 v80.5,46 81.5,46 U6.122 | U6.179 v53,46 | U6.183 v51.75,44.5 51.75,45.5 U6.181 | U6.3 v53.5,15.5 52.5,15.5 U6.1 | C35.2 v49.25,50 | C37.2 v82,53 | C38.2 50.6,12.9 v51.25,11.75 | C3.2 v22.25,73 22.5,72.75 23.25,72.75 | 23.25,72.75 v23.75,72.75 24.75,72.75 25.25,73.25 27.25,73.25 U3.7 U3.2 | C4.- 40.67,70.08 39,71.75 C6.2 v39,70 39,68.25 26.75,68.25 v23.75,71.25 23.25,71.75 23.25,72.75 | U2.2 U2.7 27.25,64.25 26,63 25.25,63 | C1.2 v22.5,63.25 22.5,63 v24,63 25.25,63 | 25.25,63 25.25,62 R2.1 26.5,62 26.25,61.75 26.25,60 27.75,58.5 35.5,58.5 38.65,61.65 C2.2 v39,60 41.5,60 41.75,60.25 C5.- | U6.221 51.5,25.5 v52,25 | U6.85 83,28 v82.56,28.44 | U6.98 83.25,34.5 v82.44,33.69 | U6.59 81.5,14.75 81,15.25 v80.5,15.25 | U6.239 51.25,16.5 v51.75,17
  Top 0.203: v74.5,46 74,46 73.5,46.5 U6.138 | C50.2 v87,13 | U6.145 70,46.5 v69.69,46.19 69.69,46.28 69.53,46.43 69.53,47.62 69.5,47.66 U6.146 | v82.56,25.81 82.62,25.81 82.81,26 U6.81 | C55.2 93.38,22.06 v93.34,22.1 | U5.2 92.48,15.73 v92.46,15.75
  Top 0.406: C31.2 v52,67.5 | v92.58,8.89 C7.2 | v91.31,25.4 C8.2
  Top 0.61: 10.23,29.9 v10.29,29.84
  Top 0.813: C53.- 49.83,70.08 v49.75,70 | C54.- 49.97,53.28 v50,53.25 | C56.- 10.23,29.9
  Bottom 0.203: C52.2 55.15,61.4 v55.5,61.75 | C30.2 58.4,61.65 v58.5,61.75 | C34.2 53.9,53.6 v54,53.63 | C51.2 60.1,53.6 v60,53.63 | C29.2 71.35,61.6 v71.5,61.75 72.25,61.75 72.65,61.35 C33.2 | C49.2 69.85,53.65 v70,53.63 | C32.2 73.75,54.75 74,54.5 v74,53.63 | C46.2 68.4,58.65 v68.5,58.75 | C15.2 81.64,38.39 v82.25,39 | C45.2 82.1,41.35 v82.25,41.5 | C14.2 61.11,45.89 v61,46 | C24.2 56.1,45.6 v56.5,46 | v52,39.5 52.64,40.14 C10.2 53.3,40.2 53.25,40.25 v54.75,40.25 C47.2 | C41.2 52.35,28.85 v52,28.5 | C11.2 53.39,32.14 53.25,32 53.25,31.25 v53,31 | C39.2 53.35,35.35 53,35 v52,35 | C21.2 53.25,44 52.75,44.5 v51.75,44.5 | C12.2 53.36,23.86 v52,22.5 | C26.2 55.15,15.9 54.75,15.5 v53.5,15.5 | C42.2 59.9,16.35 v60.5,15.75 | C13.2 64.36,15.86 v64.25,15.75 | C18.2 73.39,15.86 v73.5,15.75 | C28.2 81.25,17.25 81.5,17 v82.5,17 | v82.56,25.81 82.16,25.91 C44.2 81.09,25.91 81,26 79.9,24.9 C48.2 | C17.2 81.64,21.36 v82.25,21 | C16.2 81.89,30.36 v82.25,30.06 | C22.2 v79.75,31.12 | C19.2 82.4,33.65 v82.44,33.69 | C40.2 81.85,44.6 v82.75,45.5 | C23.2 76.15,45.85 v76,46 | C25.2 68.4,16.15 v68,15.75 | C9.2 69.6,41.85 v69.5,41.75 | C43.2 v80.5,15.25 | C20.2 74.6,45.9 v74.5,46
  Bottom 0.61: 81.11,30.36 81.25,30.5 | 81.11,30.36 C16.2 | C22.2 80.6,29.85 81.11,30.36
  other vias: 11.32,76 43.5,58.25 41.75,58.25 40.25,58.25 37.75,59.25 24,61.5 22.5,62 43.5,68.25 42,68.25 40.5,68.25 37.75,69.25 22.25,71.75 14.32,77.5 12.82,77.5 11.32,77.5 12.82,76 14.32,76 9.5,73.75 7.75,73.75 6,73.75 4.25,73.75 2.68,75.36 2.68,77.43
  pour Top: 21.5,74.5 21.5,71.5 25.5,67.5 44.25,67.5 44.25,71 40.5,71 40.5,71.25 39.75,72 38,72 38,71.75 35,69 29.75,69 26.5,70.25 26.5,72.75 28.25,72.75 28.25,74.75 29,75.5 29,75.75 28.75,75.75 28,77 26,77 26,74 25.75,73.75 25,73.75 24.75,73.5 23.5,73.5 22.75,74.25 21.75,74.25
  pour Top: 21.75,65.25 21.75,61.75 26,57.5 44.25,57.5 44.25,61 40.75,61 39.75,62 37.75,62 35,59.25 29.75,59.25 28.25,60.75 26.75,60.75 26.75,62.75 27.25,62.75 28.25,63.75 28.25,64.5 29,65.25 29,65.75 28.75,65.75 28.25,66.25 28.25,67 26,67 26,64 25,64 24.75,63.75 23.25,63.75 23.25,65.25
  pour Bottom (rank 6): 0,0 0,80 99,80 99,0
  pour Top: 2,78 14.5,78 15.25,78 15.25,76.25 13,73.75 9.75,73.5 9.5,73.25 2,73.25
  pour Top (rank 2): 99.06,0 0,0 0,80.01 99.06,80.01
I2C_SCL
  Top 0.203: U6.41 72.5,8.78 73.66,7.62 J3.12
I2C_SDA
  Top 0.203: U6.42 73,9.3 74.93,7.37 74.93,4.95 74.8,4.95 J3.11
MAIN_BRD_PWR_ON  (via drill 0.61)
  Top 0.203: JP1.1 4.02,55.58 1.65,53.21 v1.65,3.17 | v8.64,3.05 v35.18,3.05 | v44.96,2.41 56.52,2.41 57.4,3.3 60.45,3.3 J3.1
  Bottom 0.203: v1.65,3.17 8.51,3.17 v8.64,3.05 | v35.18,3.05 41.4,3.05 42.04,2.41 v44.96,2.41
N$1
  pour Top: 29,67 33.5,67 33.5,60.25 31,60.25 30.5,60.75 30.5,65 29.75,65.75 29.75,66 29.75,66.25 29,66.25
N$2
  Top 0.203: U2.1 29.05,64.55 29,64.5 29,63.75 29.5,63.25 R1.1 29.5,62.75 28.25,62.75 28.1,62.6 R2.2
N$3
  Top 0.254: U3.3 31,76.45 31,76 31.25,76 L2.1
  pour Top: 29,77 33.5,77 33.5,70 30.5,70 30.5,76 29.5,76 29.25,76.25 29,76.25
N$4
  Top 0.203: R5.2 28.25,71.75 29,72.5 29.5,72.5 R4.1 29.5,73.25 29,73.75 29,74.5 29.05,74.55 U3.1
N$5
  Top 0.203: U6.62 87,16.5 87.5,16 | 87.5,16 C36.1 | L4.1 87.14,15.64 87.5,16
N$6
  Top 0.406: LED1.C R6.2
P0
  Top 0.203: U6.191 49.03,40.5 48.58,40.96 48.42,40.96 43.02,46.35 38.35,46.35 J7.3
P1
  Top 0.203: U6.189 48.51,41.5 45.72,44.29 45.72,46.67 44.77,47.62 39.88,47.62 39.75,47.5 J7.4
P2
  Top 0.203: U6.194 48.95,39 48.58,39.37 48.58,39.38 43.94,44.02 38.12,44.02 37.08,45.06 J7.5
P3
  Top 0.203: U6.192 48.74,40 43.66,45.09 J7.6
P4
  Top 0.203: U6.199 48.87,36.5 43.89,41.48 38.15,41.48 J7.7 37.03,42.6
P5
  Top 0.203: U6.197 48.86,37.5 43.81,42.55 39.88,42.55 39.75,42.42 J7.8
P6
  Top 0.203: U6.208 48.96,32 48.26,32.7 | 48.26,32.7 | 48.26,32.7 48.1,32.86 48.1,35.24 48.07,35.24 44.37,38.94 38.1,38.94 37.06,39.98 J7.9
P7
  Top 0.203: U6.203 48.84,34.5 48.58,34.77 48.58,35.56 44.13,40.01 J7.10
P8
  Top 0.203: U6.218 49.04,27 48.74,27.3 48.74,27.62 46.67,29.69 46.67,34.29 45.09,35.88 44.93,36.04 | 44.93,36.04 | 44.93,36.04 44.93,36.05 44.58,36.4 38.12,36.4 37.08,37.44 J7.11
P9
  Top 0.203: U6.216 49.15,28 47.15,30 47.15,34.61 44.29,37.47 J7.12
P10
  Top 0.203: U6.226 49.07,23 47.47,24.61 | 47.47,24.61 | 47.47,24.61 47.31,24.77 47.31,26.83 45.24,28.89 45.24,32.43 43.81,33.86 38.15,33.86 J7.13
P11
  Top 0.203: U6.223 48.68,24.5 47.78,25.4 47.78,26.99 45.72,29.05 45.72,32.7 43.5,34.92 J7.14 39.5,34.92
P12
  Top 0.203: U6.231 48.56,20.5 45.88,23.18 45.88,26.35 43.81,28.42 43.81,30.58 43.08,31.32 38.08,31.32 37.06,32.33 37.08,32.36 J7.15
P13
  Top 0.203: U6.230 48.85,21 46.35,23.5 46.35,26.51 44.29,28.57 44.29,31.11 43.02,32.38 39.88,32.38 39.75,32.26 J7.16
P14
  Top 0.203: U6.234 47.67,19 44.45,22.23 44.45,25.43 41.35,28.52 38.35,28.52 37.06,29.82 J7.17
P15
  Top 0.203: U6.233 47.97,19.5 44.93,22.54 44.93,26.04 42.86,28.1 42.86,29.53 42.55,29.84 J7.18
P16
  Top 0.203: U6.236 47.25,18 43.5,21.75 43.5,23.28 43.08,23.7 38.12,23.7 37.08,24.74 J7.21
P17
  Top 0.203: U6.237 46.95,17.5 43.02,21.43 43.02,23.04 42.77,23.29 38.15,23.29 J7.23 37.06,22.2
P18
  Top 0.203: U6.238 46.34,17 42.7,20.64 42.7,20.67 42.29,21.08 38.48,21.08 J7.25
P19
  Top 0.203: U6.5 54.5,12.11 52.7,10.32 49.69,10.32 46.35,13.65 46.35,15.37 45.72,16 45.72,16.03 45.7,16.05 45.67,16.05 45.64,16.08 38.1,16.08 37.03,17.14 J7.27 37.06,17.12
P20
  Top 0.203: U6.4 54,13.68 53.98,13.65 53.98,12.38 52.55,10.95 49.85,10.95 46.83,13.97 46.83,15.88 45.56,17.14 J7.28 39.5,17.14
P21
  Top 0.203: U6.6 55,11.82 53.02,9.84 49.37,9.84 45.72,13.49 45.72,15.09 45.14,15.67 38.15,15.67 J7.29
P22
  Top 0.203: U6.7 55.5,11.53 53.18,9.21 48.58,9.21 45.72,12.06 | 45.72,12.06 | 45.72,12.06 44.29,13.49 38.51,13.49 J7.31
P23
  Top 0.203: U6.8 56,11.23 53.34,8.57 47.78,8.57 44.29,12.06 J7.32
P24
  Top 0.203: U6.9 56.5,10.94 53.66,8.1 46.99,8.1 44.13,10.95 38.42,10.95 38.42,10.86 J7.33
P25
  Top 0.203: U6.11 57.5,11.3 53.82,7.62 43.5,7.62 42.86,8.26 38.35,8.26 J7.35
P26
  Top 0.203: U6.13 58.5,11.51 53.98,6.99 J7.36
P27
  Top 0.203: U6.14 59,11.06 54.29,6.35 43.5,6.35 43.02,5.87 38.51,5.87 J7.37
P28
  Top 0.203: U6.18 61,10.2 54.29,3.49 44.13,3.49 43.66,3.02 38.2,3.02 J7.39
P29
  Top 0.203: U6.184 49.19,44 48.1,45.09 48.1,53.37 46.48,54.99 18.16,54.99 10.79,47.62 J1.4
P30
  Top 0.203: U6.185 49.05,43.5 47.62,44.93 47.62,53.21 46.35,54.48 18.8,54.48 10.79,46.48 10.79,46.51 5.49,46.51 J1.5
P31
  Top 0.203: U6.186 48.92,43 47.15,44.77 47.15,53.05 46.35,53.85 19.94,53.85 11.18,45.09 J1.6
P32
  Top 0.203: U6.187 48.78,42.5 46.67,44.61 46.67,52.9 46.23,53.34 21.21,53.34 11.68,43.81 | 11.68,43.81 11.75,43.81 | 11.68,43.81 5.33,43.81 J1.7
P33
  Top 0.203: U6.195 48.8,38.5 43.81,43.48 43.79,43.48 43.66,43.61 37.8,43.61 37.59,43.81 30.35,43.81 29.59,44.58 13.59,44.58 11.56,42.55 J1.8
P34
  Top 0.203: U6.200 48.77,36 43.81,40.96 43.81,40.97 43.71,41.07 37.8,41.07 37.57,41.3 30.45,41.3 29.06,42.7 | 29.06,42.7 29.01,42.75 | 29.06,42.7 28.57,43.18 13.49,43.18 11.59,41.27 5.33,41.27 J1.9
P35
  Top 0.203: U6.214 48.95,29 47.62,30.32 47.62,34.92 45.09,37.47 | 45.09,37.47 | 45.09,37.47 | 45.09,37.47 44.02,38.53 37.77,38.53 37.57,38.73 32.03,38.73 31.7,39.06 | 31.7,39.06 31.67,39.09 | 31.7,39.06 28.38,42.39 13.56,42.39 11.18,40.01 J1.10
P36
  Top 0.203: U6.222 48.98,25 48.42,25.56 | 48.42,25.56 | 48.42,25.56 48.26,25.72 48.26,27.3 46.2,29.37 46.2,33.41 43.61,35.99 37.77,35.99 37.54,36.22 33.38,36.22 28.32,41.27 13.46,41.27 10.92,38.73 5.33,38.73 J1.11
P37
  Top 0.203: U6.228 48.96,22 46.83,24.13 46.83,26.67 44.77,28.73 44.77,32.07 44.45,32.38 | 44.45,32.38 | 44.45,32.38 | 44.45,32.38 43.38,33.45 37.8,33.45 37.59,33.66 33.96,33.66 27.3,40.31 27.3,40.32 13.81,40.32 10.95,37.47 6.73,37.47 6.6,37.34 J1.12
P38
  Top 0.203: U6.232 48.26,20 45.4,22.86 45.4,26.19 43.34,28.26 43.34,30.3 42.72,30.91 37.74,30.91 37.54,31.11 33.81,31.11 26.04,38.89 14.13,38.89 11.43,36.2 5.33,36.2 J1.13
P39
  Top 0.203: U6.235 47.38,18.5 43.97,21.91 43.97,24.77 42.86,25.88 41.59,25.88 41.45,26.01 35.64,26.01 24.82,36.83 | 24.82,36.83 24.84,36.83 | 24.82,36.83 13.65,36.83 11.75,34.92 J1.14
P_CLK  (via drill 0.61)
  Top 0.203: U6.16 60,10.47 53.85,4.32 42.16,4.32 v41.78,3.94 | v35.43,5.71 12.95,5.71 7.87,10.79 5.33,10.79 J6.11
  Bottom 0.203: v41.78,3.94 41.78,4.95 41.02,5.71 v35.43,5.71
P_CS_N
  Top 0.203: U6.15 59.5,10.61 53.66,4.76 39.94,4.76 J7.38
P_RST_N
  Top 0.203: U6.188 48.65,42 46.2,44.45 46.2,47.78 45.09,48.9 38.35,48.9 J7.1
PWR_ON  (via drill 0.51)
  Top 0.203: v22.22,78.25 18.5,78.25 13.25,73 11.25,73 10.5,72.75 5,72.75 5,70.75 1.75,67.5 | U3.6 24.05,74.55 v24,74.5 | 18.75,64.5 v20.5,64.5 | U2.6 24.25,64.55 v24.25,64.5
  Top 0.254: 18.75,64.5 18.5,64.5 15.5,61.5 15.5,59 15.25,58.75 | 15.25,58.75 R3.2 | 1.75,67.5 1.75,59.25 3,58 10.25,58 11.5,56.75 11.5,55.5 | 15.25,58.75 15.25,57.5 13.25,55.5 11.5,55.5 | 11.5,55.5 11.56,55.56 JP1.2
  Bottom 0.203: v20.5,64.5 v24.25,64.5 | v24,74.5 24,78.25 v22.22,78.25
RAS_N
  Top 0.203: U1.19 65.03,65.47 65,65.5 65,65.75 69.25,70 80,70 88.25,61.75 88.25,42 87.25,41 U6.111
RISC_TCK
  Top 0.203: U6.50 77,11.77 81.28,7.49 J3.18
RISC_TDI
  Top 0.203: U6.55 79.5,11.94 83.06,8.38 85.47,8.38 86.36,7.49 J3.22
RISC_TDO
  Top 0.203: U6.51 77.5,12.04 82.55,6.99 82.55,5.08 J3.19
RISC_TMS
  Top 0.203: U6.52 78,12.17 J3.20
RISC_TRST
  Top 0.203: U6.54 79,11.82 78.99,11.81 82.93,7.87 84.2,7.87 85.09,6.99 85.09,5.08 J3.21
SPI_CS_N
  Top 0.203: U6.44 74,9.44 76.2,7.24 J3.14
SPI_MASTER_DIN
  Top 0.203: U6.49 76.5,10.49 80.01,6.99 80.01,5.08 J3.15
SPI_MASTER_DOUT
  Top 0.203: U6.27 65.5,10.7 67.31,8.89 68.58,8.89 69.85,7.62 69.85,5.08 J3.9 69.98,2.67 69.98,2.54 62.87,2.54 62.1,3.3 62.1,4.45 61.47,5.08 60.45,5.08 59.69,5.84 59.69,7.62 62,9.93 U6.20
SYS_CLK
  Top 0.203: 67,14 U6.30 67,11.27 68.96,11.27 | 68.99,13.75 68.99,13.77 | 68.99,13.75 U6.34 | 68.96,11.27 69.27,11.27 72.36,8.18 72.36,3.02 73.05,2.34 92.25,2.34 92.71,2.79 92.71,7.37 92.2,7.87 91.06,7.87 90.17,8.76 90.17,11.05 90.83,11.71 92.99,11.71 95.25,13.97 96.52,13.97 96.54,13.99 U5.3 | 68.96,11.27 68.96,11.3 68.99,11.33 68.99,13.75
UART_RX
  Top 0.203: U6.57 80.5,12.46 83.31,9.65 86.11,9.65 87.63,8.13 88.39,8.13 88.9,7.62 J3.24
UART_TX
  Top 0.203: U6.56 80,12.2 83.19,9.02 85.85,9.02 87.63,7.24 87.63,5.08 J3.23
WATCHDOG_STROBE
  Top 0.203: U6.46 75,9.71 77.47,7.24 77.47,5.08 J3.13
WE_N
  Top 0.203: U1.17 66.03,64.97 66,65 66,65.25 69.75,69 79.5,69 87.25,61.25 87.25,43 86.75,42.5 U6.114

## Text on the board
tPlace: OpenCores Eval V1.6 | Base2Designs (c) 2008
_tsilk: U3 | C3 | L2 | C6 | C4 | R6 | R5 | R4 | C53 | OpenCores Eval V1.6 | C1 | U2 | L1 | C2 | Base2Designs (c) 2008 | C5 | C31 | LED1 | R2 | R1 | GND | R3 | JP1 | C54 | 1 | J1 | 1 | J7 | 180 | C37 | C35 | U1 | 121 | 181 | 120 | 14 | C56 | U6 | J6 | C8 | 1 | C55 | U5 | C36 | 240 | C38 | 61 | L4 | 1 | C50 | C7 | J3 | 60 | 30 | 20 | 40 | 1
_bsilk: C52 | C30 | C33 | C46 | C29 | C34 | C51 | C49 | C32 | C14 | C9 | C23 | C24 | C20 | C40 | C21 | C45 | C10 | C47 | C15 | C19 | C39 | C16 | C11 | C22 | C41 | C48 | C12 | C44 | C17 | C27 | C28 | C26 | C42 | C13 | C25 | C18 | C43